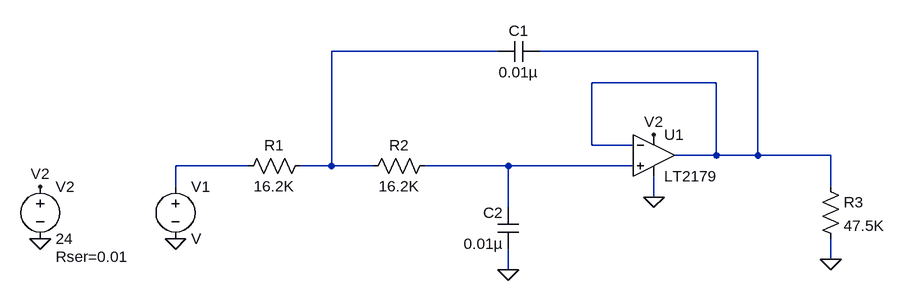
[diagram p0: schematic Sallen-Key_LowPassFilter.asc]
Sallen-Key_LowPassFilter.asc, the LTspice schematic file:
Version 4
SHEET 1 1200 680
WIRE 592 -16 336 -16
WIRE 992 -16 656 -16
WIRE 928 32 736 32
WIRE 736 128 736 32
WIRE 800 128 736 128
WIRE 928 144 928 32
WIRE 928 144 864 144
WIRE 992 144 992 -16
WIRE 992 144 928 144
WIRE 1104 144 992 144
WIRE 208 160 96 160
WIRE 336 160 336 -16
WIRE 336 160 288 160
WIRE 400 160 336 160
WIRE 608 160 480 160
WIRE 800 160 608 160
WIRE 96 192 96 160
WIRE 1104 192 1104 144
WIRE 832 208 832 176
WIRE 608 224 608 160
WIRE 1104 304 1104 272
WIRE 608 320 608 288
FLAG 608 320 0
FLAG 832 208 0
FLAG 96 272 0
FLAG 1104 304 0
FLAG -112 192 V2
FLAG 832 112 V2
FLAG -112 272 0
SYMBOL res 192 176 R270
WINDOW 0 32 56 VTop 2
WINDOW 3 0 56 VBottom 2
SYMATTR InstName R1
SYMATTR Value 16.2K
SYMATTR SpiceLine tol=1 pwr=0.1
SYMBOL res 384 176 R270
WINDOW 0 32 56 VTop 2
WINDOW 3 0 56 VBottom 2
SYMATTR InstName R2
SYMATTR Value 16.2K
SYMATTR SpiceLine tol=1 pwr=0.1
SYMBOL cap 592 0 R270
WINDOW 0 32 32 VTop 2
WINDOW 3 0 32 VBottom 2
SYMATTR InstName C1
SYMATTR Value 0.01µ
SYMATTR SpiceLine V=50 Irms=272m Rser=0.391699 Lser=0 mfg="KEMET" pn="C0805C103K5RAC" type="X7R"
SYMBOL Opamps\\LT2179 832 80 R0
SYMATTR InstName U1
SYMBOL voltage 96 176 R0
SYMATTR InstName V1
SYMBOL res 1088 176 R0
SYMATTR InstName R3
SYMATTR Value 47.5K
SYMATTR SpiceLine tol=1 pwr=0.1
SYMBOL cap 624 288 R180
WINDOW 0 24 56 Left 2
WINDOW 3 24 8 Left 2
SYMATTR InstName C2
SYMATTR Value 0.01µ
SYMATTR SpiceLine V=50 Irms=272m Rser=0.391699 Lser=0 mfg="KEMET" pn="C0805C103K5RAC" type="X7R"
SYMBOL voltage -112 176 R0
WINDOW 123 0 0 Left 2
WINDOW 39 24 124 Left 2
SYMATTR InstName V2
SYMATTR Value 24
SYMATTR SpiceLine Rser=0.01

The netlist it stands for:
* Sallen-Key_LowPassFilter.asc
R1 N003 N001 16.2K tol=1 pwr=0.1
R2 N001 N004 16.2K tol=1 pwr=0.1
C1 N001 N002 0.01µ V=50 Irms=272m Rser=0.391699 Lser=0 mfg="KEMET" pn="C0805C103K5RAC" type="X7R"
XU1 N004 N002 V2 0 N002 LT2179  ; pins In+ In- V+ V- OUT
V1 N003 0 V
R3 N002 0 47.5K tol=1 pwr=0.1
C2 0 N004 0.01µ V=50 Irms=272m Rser=0.391699 Lser=0 mfg="KEMET" pn="C0805C103K5RAC" type="X7R"
V2 V2 0 24 Rser=0.01
.backanno
.end